# Altium project QUTMS-STRWHL-V00.PrjPcb
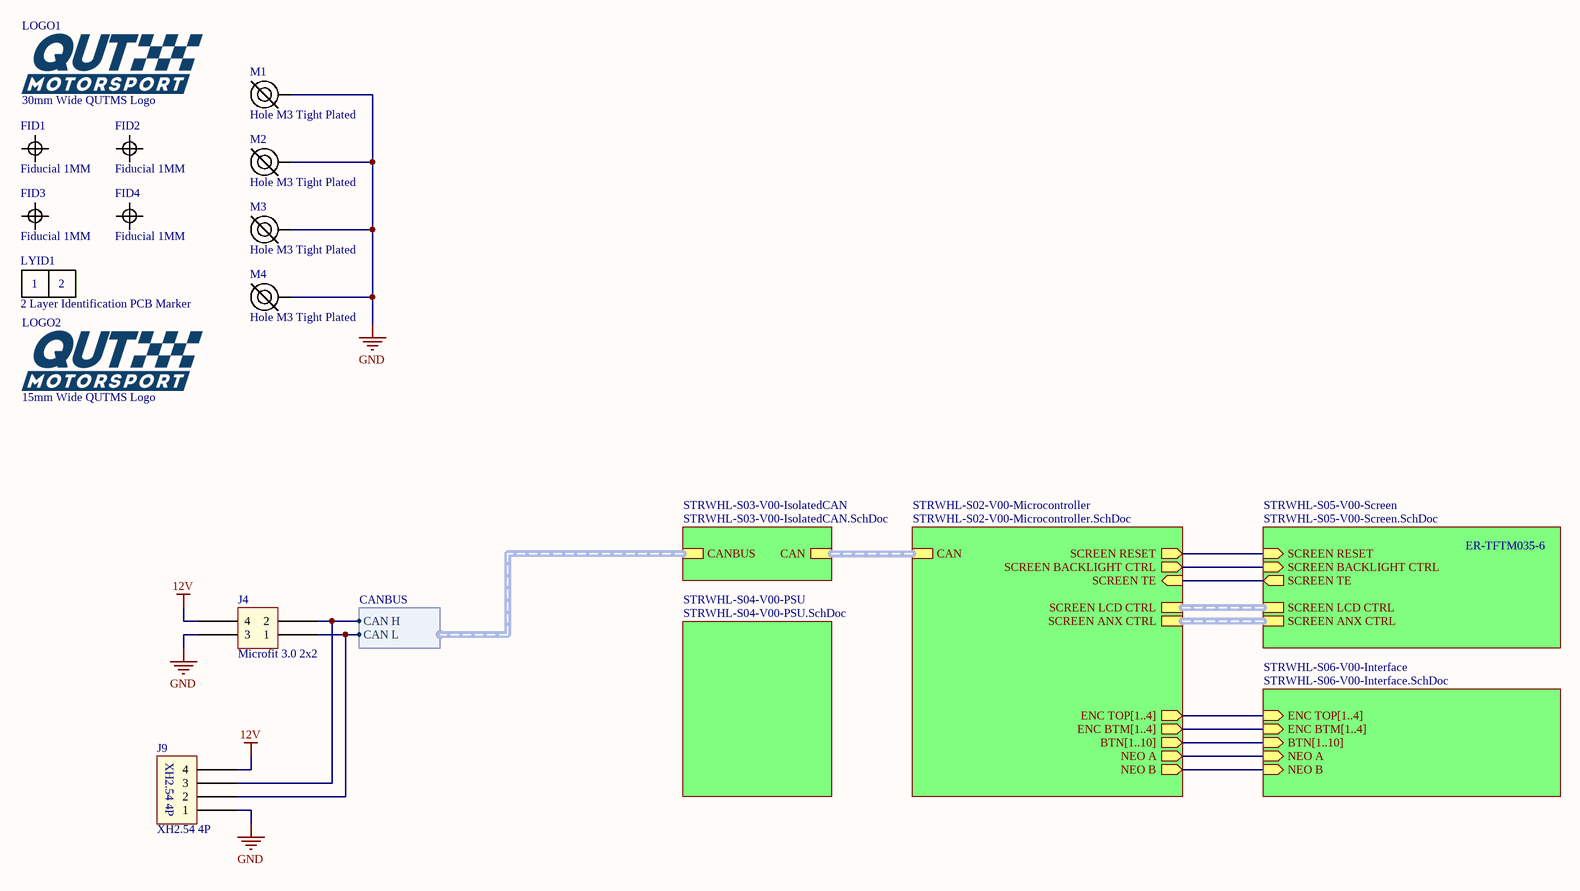
[diagram p0: STRWHL-S01-V00-SteeringWheel.SchDoc]
9 sheets, 176 parts. Net scope: hierarchical (ports join the sheet entries above them; power ports are global).
Board file: STRWHL-P01-V00.PcbDoc
Sheets:
  STRWHL-S01-V00-SteeringWheel.SchDoc
    STRWHL-S04-V00-PSU = STRWHL-S04-V00-PSU.SchDoc
    STRWHL-S02-V00-Microcontroller = STRWHL-S02-V00-Microcontroller.SchDoc
    STRWHL-S03-V00-IsolatedCAN = STRWHL-S03-V00-IsolatedCAN.SchDoc
    STRWHL-S06-V00-Interface = STRWHL-S06-V00-Interface.SchDoc
      STRWHL-S07-V00-EncoderInput1 = STRWHL-S07-V00-EncoderInput.SchDoc
      STRWHL-S07-V00-EncoderInput2 = STRWHL-S07-V00-EncoderInput.SchDoc
      STRWHL-S07-V00-EncoderInput3 = STRWHL-S07-V00-EncoderInput.SchDoc
      STRWHL-S07-V00-EncoderInput4 = STRWHL-S07-V00-EncoderInput.SchDoc
      STRWHL-S08-V00-ButtonInput1 = STRWHL-S08-V00-ButtonInput.SchDoc
      STRWHL-S08-V00-ButtonInput2 = STRWHL-S08-V00-ButtonInput.SchDoc
      STRWHL-S08-V00-ButtonInput3 = STRWHL-S08-V00-ButtonInput.SchDoc
      STRWHL-S08-V00-ButtonInput4 = STRWHL-S08-V00-ButtonInput.SchDoc
      STRWHL-S08-V00-ButtonInput5 = STRWHL-S08-V00-ButtonInput.SchDoc
      STRWHL-S08-V00-ButtonInput6 = STRWHL-S08-V00-ButtonInput.SchDoc
      STRWHL-S08-V00-ButtonInput7 = STRWHL-S08-V00-ButtonInput.SchDoc
      STRWHL-S08-V00-ButtonInput8 = STRWHL-S08-V00-ButtonInput.SchDoc
      STRWHL-S08-V00-ButtonInput9 = STRWHL-S08-V00-ButtonInput.SchDoc
      STRWHL-S08-V00-ButtonInput10 = STRWHL-S08-V00-ButtonInput.SchDoc
      STRWHL-S04-V00-PSU-LEDs = STRWHL-S04-V00-PSU-LEDs.SchDoc
    STRWHL-S05-V00-Screen = STRWHL-S05-V00-Screen.SchDoc

## Sheet STRWHL-S01-V00-SteeringWheel.SchDoc
size A3

### Parts
FID1  Fiducial 1MM  [FIDUCIAL 1MM]
FID2  Fiducial 1MM  [FIDUCIAL 1MM]
FID3  Fiducial 1MM  [FIDUCIAL 1MM]
FID4  Fiducial 1MM  [FIDUCIAL 1MM]
J4  Microfit 3.0 2x2  [Microfit_2X2_R_TH]
J9  XH2.54 4P  [JST_XH254_4P_TH_RH]
LOGO1  30mm Wide QUTMS Logo  [QUTMS LOGO 30MM]
LOGO2  15mm Wide QUTMS Logo  [QUTMS LOGO 15MM]
LYID1  2 Layer Identification PCB Marker  [LAYER IDENT 2]
M1  Hole M3 Tight Plated  [M3.2 PLATED]
M2  Hole M3 Tight Plated  [M3.2 PLATED]
M3  Hole M3 Tight Plated  [M3.2 PLATED]
M4  Hole M3 Tight Plated  [M3.2 PLATED]

### Sub-sheets
STRWHL-S02-V00-Microcontroller = STRWHL-S02-V00-Microcontroller.SchDoc: SCREEN LCD CTRL (harness SCREEN LCD CTRL), SCREEN ANX CTRL (harness SCREEN ANX CTRL), SCREEN TE (in), SCREEN BACKLIGHT CTRL (out), SCREEN RESET (out), CAN (harness CAN), ENC TOP[1..4] (out), ENC BTM[1..4] (out), BTN[1..10] (out), NEO A (out), NEO B (out)
STRWHL-S03-V00-IsolatedCAN = STRWHL-S03-V00-IsolatedCAN.SchDoc: CANBUS (harness CANBUS), CAN (harness CAN)
STRWHL-S04-V00-PSU = STRWHL-S04-V00-PSU.SchDoc: no entries
STRWHL-S05-V00-Screen = STRWHL-S05-V00-Screen.SchDoc: SCREEN ANX CTRL (harness SCREEN ANX CTRL), SCREEN LCD CTRL (harness SCREEN LCD CTRL), SCREEN TE (out), SCREEN BACKLIGHT CTRL (in), SCREEN RESET (in)
STRWHL-S06-V00-Interface = STRWHL-S06-V00-Interface.SchDoc: BTN[1..10] (in), ENC TOP[1..4] (in), NEO B (in), ENC BTM[1..4] (in), NEO A (in)

### Harnesses
CANBUS: CAN H, CAN L

### Nets
12V: J4.4 J9.4
GND: J4.3 J9.1 M1.1 M2.1 M3.1 M4.1
CAN H: J4.2 J9.3 ; sheet STRWHL-S03-V00-IsolatedCAN/CANBUS.CAN H
CAN L: J4.1 J9.2 ; sheet STRWHL-S03-V00-IsolatedCAN/CANBUS.CAN L
NEO A: sheet STRWHL-S02-V00-Microcontroller/NEO A, sheet STRWHL-S06-V00-Interface/NEO A
NEO B: sheet STRWHL-S02-V00-Microcontroller/NEO B, sheet STRWHL-S06-V00-Interface/NEO B
SCREEN BKLIGHT: sheet STRWHL-S02-V00-Microcontroller/SCREEN BACKLIGHT CTRL, sheet STRWHL-S05-V00-Screen/SCREEN BACKLIGHT CTRL
SCREEN RESET: sheet STRWHL-S02-V00-Microcontroller/SCREEN RESET, sheet STRWHL-S05-V00-Screen/SCREEN RESET
SCREEN TE: sheet STRWHL-S02-V00-Microcontroller/SCREEN TE, sheet STRWHL-S05-V00-Screen/SCREEN TE

### Buses and harness runs
bus sheet STRWHL-S02-V00-Microcontroller/BTN[1..10] = sheet STRWHL-S06-V00-Interface/BTN[1..10]
bus sheet STRWHL-S02-V00-Microcontroller/ENC BTM[1..4] = sheet STRWHL-S06-V00-Interface/ENC BTM[1..4]
bus sheet STRWHL-S02-V00-Microcontroller/ENC TOP[1..4] = sheet STRWHL-S06-V00-Interface/ENC TOP[1..4]
harness sheet STRWHL-S02-V00-Microcontroller/CAN = sheet STRWHL-S03-V00-IsolatedCAN/CAN
harness sheet STRWHL-S02-V00-Microcontroller/SCREEN ANX CTRL = sheet STRWHL-S05-V00-Screen/SCREEN ANX CTRL
harness sheet STRWHL-S02-V00-Microcontroller/SCREEN LCD CTRL = sheet STRWHL-S05-V00-Screen/SCREEN LCD CTRL

### Notes on the sheet
- ER-TFTM035-6
- Revision History:
- Sheet Title:
- Rev
- Date
- Description
- Project:
- Size:
- Drawn By:
- A3
- Number:
- Revision:
- Sheet
- Version:
- of
- QUT Motorsport
- O-120, Gardens Point
- 2 George Street
- Brisbane, QLD 4000
- Australia
- Print Date:
- Print Time:
- File Name:
- (in symbol Layer Identification 2) 1; 2

### Library data of the parts
J4 = Microfit_2x2
LOGO1 = QUTMS Logo 30mm
LOGO2 = QUTMS Logo 15mm
LYID1 = Layer Identification 2
M1-M4 = Hole M3 Tight Plated: M3.2 Hole, Plated

## Sheet STRWHL-S04-V00-PSU.SchDoc: Power Supply (9-25V to 3v3 @ 0.1-0.3A)
size A3; DrawnBy: Jonn Dillon; DocumentNumber: 4; Revision: 00; SheetNumber: 4; SheetTotal: 9; Project: Steering Wheel 2020; PageSetup: Record=PageOptions|CenterHorizontal=True|CenterVertical=True|PrintScale=0.97|XCorrection=1.00|YCorrection=1.00|PrintKind=0|BorderSize=5000000|LeftOffset=0|BottomOffset=0|Orientation=2|PaperLength=1000|PaperWidth=1000|Scale=100|PaperSource=7|PrintQuality=-4|MediaType=1|DitherType=10|PaperKind=A4|PrintScaleMode=1
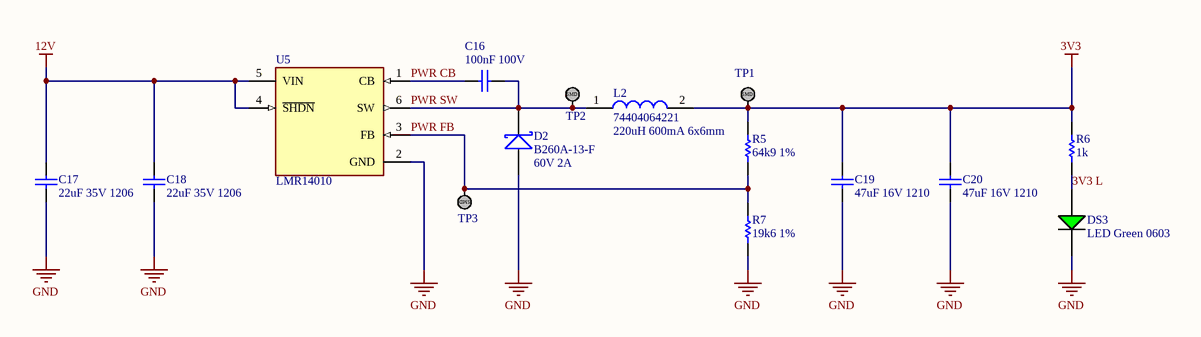
[diagram p1: STRWHL-S04-V00-PSU.SchDoc]

### Parts
C16  100nF 100V  [Cap_Ceramic_0603]
C17  22uF 35V 1206  [Cap_Ceramic_1206]
C18  22uF 35V 1206  [Cap_Ceramic_1206]
C19  47uF 16V 1210  [Cap_Ceramic_1210]
C20  47uF 16V 1210  [Cap_Ceramic_1210]
D2  B260A-13-F  [SMA]
DS3  LED Green 0603  [LED GREEN 0603]
L2  74404064221  [Inductor_6x6mm]
R5  64k9 1%  [Res_ThinFilm_0603]
R6  1k  [Res_ThinFilm_0603]
R7  19k6 1%  [Res_ThinFilm_0603]
TP1  TestPoint_SMD  [TestPointSMD]  (value not drawn)
TP2  TestPoint_SMD  [TestPointSMD]  (value not drawn)
TP3  TestPoint_SMD  [TestPointSMD]  (value not drawn)
U5  LMR14010  [LMR14010]

### Nets
3V3: C19.2 C20.2 L2.2 R5.2 R6.2 TP1.1
12V: C17.2 C18.2 U5.4(~{SHDN}) U5.5(VIN)
GND: C17.1 C18.1 C19.1 C20.1 D2.A DS3.2(C) R7.1 U5.2(GND)
3V3 L: DS3.1(A) R6.1
PWR CB: C16.1 U5.1(CB)
PWR FB: R5.1 R7.2 TP3.1 U5.3(FB)
PWR SW: C16.2 D2.K L2.1 TP2.1 U5.6(SW)

### Notes on the sheet
- (near L2) 220uH 600mA 6x6mm
- (near D2) 60V 2A
- Revision History:
- Sheet Title:
- Rev
- Date
- Description
- Project:
- Size:
- Drawn By:
- A3
- Number:
- Revision:
- Sheet
- Version:
- of
- QUT Motorsport
- O-120, Gardens Point
- 2 George Street
- Brisbane, QLD 4000
- Australia
- Print Date:
- Print Time:
- File Name:
- (in symbol TestPoint_SMD) SMD

### Library data of the parts
C16 = 100nF 100V 5% X7R 0603: Capacitor, Ceramic, SMD, 100nF, 100V, 5%, X7R, 0603
C17 C18 = 22uF 35V 10% X7R 1206: Capacitor, Ceramic, SMD, 22uF, 35V, 10%, X7R, 1206
C19 C20 = 47uF 16V 10% X7R 1210: Capacitor, Ceramic, SMD, 47uF, 16V, 5%, X7R, 1210
D2 = B260A-13-F: Diode, Schottky Barrier Rectifier, 60 V, 2 A, B260A-13-F
L2 = 74404064221: FIXED IND 220UH 660MA 850 MOHM; ComponentLink1Description: Digikey; ComponentLink1URL: https://www.digikey.com.au/product-detail/en/w%C3%BCrth-elektronik/74404064221/732-7261-1-ND/5353241; ComponentLink2Description: LCSC A; ComponentLink2URL: https://lcsc.com/product-detail/Power-Inductors_Sunlord-SWPA6045S221MT_C91047.html; ComponentLink3Description: LCSC B; ComponentLink3URL: https://lcsc.com/product-detail/Power-Inductors_SXN-Shun-Xiang-Nuo-Elec-SMNR6045-221MT_C467145.html
R5 = 64k9 1% 0603: Resistor, SMD, 64k9, 0.1W, 5%, 0603
R6 = 1k 5% 0603: Resistor, SMD, 1k, 0.1W, 5%, 0603
R7 = 19k6 1% 0603: Resistor, SMD, 19k6, 0.1W, 5%, 0603

## Sheet STRWHL-S02-V00-Microcontroller.SchDoc: Microcontroller
size A3; DrawnBy: Jonn DIllon; DocumentNumber: 2; Revision: 00; SheetNumber: 2; SheetTotal: 9; Project: Steering Wheel 2020; PageSetup: Record=PageOptions|CenterHorizontal=True|CenterVertical=True|PrintScale=0.97|XCorrection=1.00|YCorrection=1.00|PrintKind=0|BorderSize=5000000|LeftOffset=0|BottomOffset=0|Orientation=2|PaperLength=1000|PaperWidth=1000|Scale=100|PaperSource=7|PrintQuality=-4|MediaType=1|DitherType=10|PaperKind=A4|PrintScaleMode=1
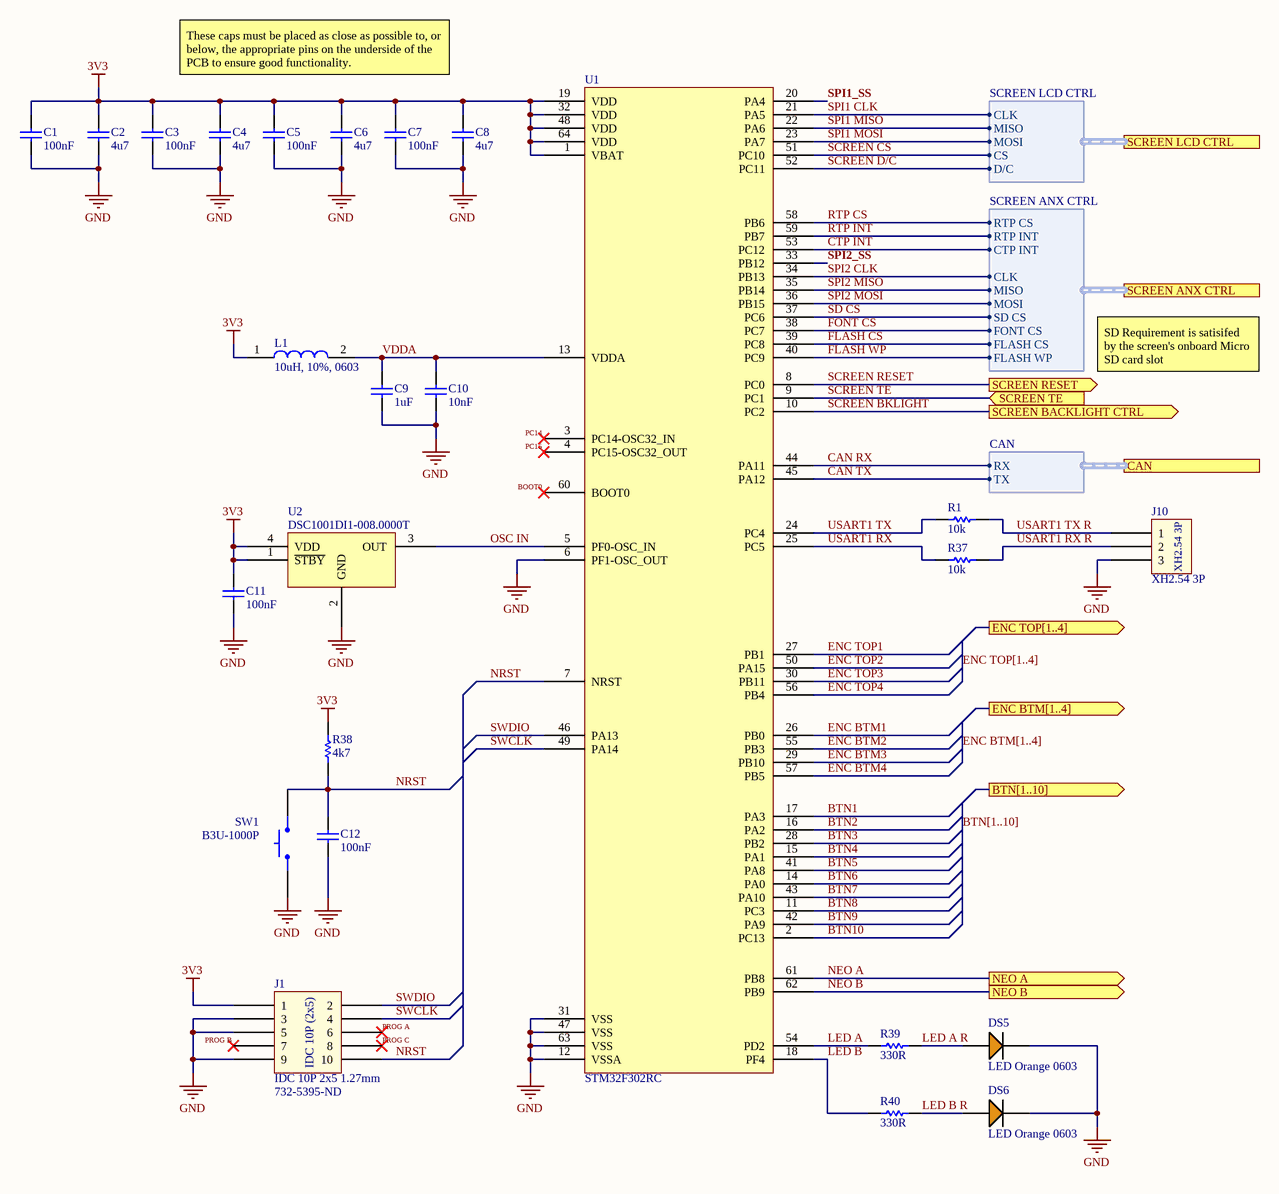
[diagram p2: STRWHL-S02-V00-Microcontroller.SchDoc]

### Parts
C1  100nF  [Cap_Ceramic_0603]
C2  4u7  [Cap_Ceramic_0603]
C3  100nF  [Cap_Ceramic_0603]
C4  4u7  [Cap_Ceramic_0603]
C5  100nF  [Cap_Ceramic_0603]
C6  4u7  [Cap_Ceramic_0603]
C7  100nF  [Cap_Ceramic_0603]
C8  4u7  [Cap_Ceramic_0603]
C9  1uF  [Cap_Ceramic_0603]
C10  10nF  [Cap_Ceramic_0603]
C11  100nF  [Cap_Ceramic_0603]
C12  100nF  [Cap_Ceramic_0603]
DS5  LED Orange 0603  [LED ORANGE 0603]
DS6  LED Orange 0603  [LED ORANGE 0603]
J1  IDC 10P 2x5 1.27mm  [IDC 1.27MM 10P]
J10  XH2.54 3P  [JST_XH254_3P_TH_RH]
L1  10uH, 10%, 0603  [Inductor_0603]
R1  10k  [Res_ThinFilm_0603]
R37  10k  [Res_ThinFilm_0603]
R38  4k7  [Res_ThinFilm_0603]
R39  330R  [Res_ThinFilm_0603]
R40  330R  [Res_ThinFilm_0603]
SW1  B3U-1000P  [BTN B3U-1000P]
U1  STM32F302RC  [STM32F302RC]
U2  DSC1001DI1-008.0000T  [DSC1001DI1-008.0000TCT-ND]

### Ports
BTN[1..10] (out), CAN (harness CAN), ENC BTM[1..4] (out), ENC TOP[1..4] (out), NEO A (out), NEO B (out), SCREEN ANX CTRL (harness SCREEN ANX CTRL), SCREEN BACKLIGHT CTRL (out), SCREEN LCD CTRL (harness SCREEN LCD CTRL), SCREEN RESET (out), SCREEN TE (in)

### Harnesses
CAN: RX, TX
SCREEN LCD CTRL: CLK, MOSI, MISO, CS, D/C
SCREEN ANX CTRL: CLK, MISO, MOSI, RTP CS, RTP INT, CTP INT, SD CS, FONT CS, FLASH CS, FLASH WP

### Nets
3V3: C1.2 C2.2 C3.2 C4.2 C5.2 C6.2 C7.2 C8.2 C11.2 J1.1 L1.1 R38.2 U1.1(VBAT) U1.19(VDD) U1.32(VDD) U1.48(VDD) U1.64(VDD) U2.1(~{STBY}) U2.4(VDD)
GND: C1.1 C2.1 C3.1 C4.1 C5.1 C6.1 C7.1 C8.1 C9.1 C10.1 C11.1 C12.1 DS5.2(C) DS6.2(C) J1.3 J1.5 J1.9 J10.3 SW1.1 U1.6(PF1-OSC_OUT) U1.12(VSSA) U1.31(VSS) U1.47(VSS) U1.63(VSS) U2.2(GND)
BOOT0: U1.60(BOOT0)
BTN1: U1.17(PA3)
BTN2: U1.16(PA2)
BTN3: U1.28(PB2)
BTN4: U1.15(PA1)
BTN5: U1.41(PA8)
BTN6: U1.14(PA0)
BTN7: U1.43(PA10)
BTN8: U1.11(PC3)
BTN9: U1.42(PA9)
BTN10: U1.2(PC13)
CAN RX: U1.44(PA11) ; port CAN.RX
CAN TX: U1.45(PA12) ; port CAN.TX
CTP INT: U1.53(PC12) ; port SCREEN ANX CTRL.CTP INT
ENC BTM1: U1.26(PB0)
ENC BTM2: U1.55(PB3)
ENC BTM3: U1.29(PB10)
ENC BTM4: U1.57(PB5)
ENC TOP1: U1.27(PB1)
ENC TOP2: U1.50(PA15)
ENC TOP3: U1.30(PB11)
ENC TOP4: U1.56(PB4)
FLASH CS: U1.39(PC8) ; port SCREEN ANX CTRL.FLASH CS
FLASH WP: U1.40(PC9) ; port SCREEN ANX CTRL.FLASH WP
FONT CS: U1.38(PC7) ; port SCREEN ANX CTRL.FONT CS
LED A: R39.1 U1.54(PD2)
LED A R: DS5.1(A) R39.2
LED B: R40.1 U1.18(PF4)
LED B R: DS6.1(A) R40.2
NEO A: U1.61(PB8) ; port NEO A
NEO B: U1.62(PB9) ; port NEO B
NRST: C12.2 J1.10 R38.1 SW1.2 U1.7(NRST)
OSC IN: U1.5(PF0-OSC_IN) U2.3(OUT)
PC14: U1.3(PC14-OSC32_IN)
PC15: U1.4(PC15-OSC32_OUT)
PROG A: J1.6
PROG B: J1.7
PROG C: J1.8
RTP CS: U1.58(PB6) ; port SCREEN ANX CTRL.RTP CS
RTP INT: U1.59(PB7) ; port SCREEN ANX CTRL.RTP INT
SCREEN BKLIGHT: U1.10(PC2) ; port SCREEN BACKLIGHT CTRL
SCREEN CS: U1.51(PC10) ; port SCREEN LCD CTRL.CS
SCREEN D/C: U1.52(PC11) ; port SCREEN LCD CTRL.D/C
SCREEN RESET: U1.8(PC0) ; port SCREEN RESET
SCREEN TE: U1.9(PC1) ; port SCREEN TE
SD CS: U1.37(PC6) ; port SCREEN ANX CTRL.SD CS
SPI1 CLK: U1.21(PA5) ; port SCREEN LCD CTRL.CLK
SPI1 MISO: U1.22(PA6) ; port SCREEN LCD CTRL.MISO
SPI1 MOSI: U1.23(PA7) ; port SCREEN LCD CTRL.MOSI
SPI1_SS: U1.20(PA4)
SPI2 CLK: U1.34(PB13) ; port SCREEN ANX CTRL.CLK
SPI2 MISO: U1.35(PB14) ; port SCREEN ANX CTRL.MISO
SPI2 MOSI: U1.36(PB15) ; port SCREEN ANX CTRL.MOSI
SPI2_SS: U1.33(PB12)
SWCLK: J1.4 U1.49(PA14)
SWDIO: J1.2 U1.46(PA13)
USART1 RX: R37.1 U1.25(PC5)
USART1 RX R: J10.2 R37.2
USART1 TX: R1.1 U1.24(PC4)
USART1 TX R: J10.1 R1.2
VDDA: C9.2 C10.2 L1.2 U1.13(VDDA)

### Buses and harness runs
bus BTN[1..10] = port BTN[1..10]
bus ENC BTM[1..4] = port ENC BTM[1..4]
bus ENC TOP[1..4] = port ENC TOP[1..4]

### Notes on the sheet
- These caps must be placed as close as possible to, or below, the appropriate pins on the underside of the PCB to ensure good functionality.
- SD Requirement is satisifed by the screen's onboard Micro SD card slot
- (near J1) 732-5395-ND
- Revision History:
- Sheet Title:
- Rev
- Date
- Description
- Project:
- Size:
- Drawn By:
- A3
- Number:
- Revision:
- Sheet
- Version:
- of
- QUT Motorsport
- O-120, Gardens Point
- 2 George Street
- Brisbane, QLD 4000
- Australia
- Print Date:
- Print Time:
- File Name:
- (in symbol IDC 10P 2x5 1.27mm) IDC 10P (2x5)

### Library data of the parts
C1 C3 C5 C7 C11 C12 = 100nF 50V 5% X7R 0603: Capacitor, Ceramic, SMD, 100nF, 50V, 5%, X7R, 0603
C2 C4 C6 C8 = 4u7 50V 5% X7R 0603: Capacitor, Ceramic, SMD, 4u7, 50V, 5%, X7R, 0603
C9 = 1uF 25V 5% X7R 0603: Capacitor, Ceramic, SMD, 1uF, 25V, 5%, X7R, 0603
C10 = 10nF 50V 5% X7R 0603: Capacitor, Ceramic, SMD, 10nF, 50V, 5%, X7R, 0603
R1 R37 = 10k 5% 0603: Resistor, SMD, 10k, 0.1W, 5%, 0603
R38 = 4k7 5% 0603: Resistor, SMD, 4k7, 0.1W, 5%, 0603
R39 R40 = 330R 5% 0603: Resistor, SMD, 330R, 0.1W, 5%, 0603
SW1 = BTN B3U-1000P: Omron B3U-1000P Ultra Miniture Switch; ComponentLink1Description: LCSC; ComponentLink1URL: https://lcsc.com/product-detail/Tactile-Switches_BRIGHT-TSA063G50-250_C294565.html
U1 = STM32F302RC: ARM® Cortex®-M4 STM32F3 Microcontroller IC 32-Bit 72MHz 256KB (256K x 8) FLASH 64-LQFP (10x10); ComponentLink1Description: Digikey; ComponentLink1URL: https://www.digikey.com.au/product-detail/en/stmicroelectronics/STM32F302RCT6TR/497-19000-1-ND/9974332; ComponentLink2Description: Datasheet; ComponentLink2URL: http://www.st.com/content/ccc/resource/technical/document/datasheet/67/73/21/b9/f2/b3/4d/f8/DM00094064.pdf/files/DM00094064.pdf/jcr:content/translations/en.DM00094064.pdf
U2 = DSC1001DI1-008.0000T: on 8MHz XO (Standard) CMOS Oscillator 1.8 ~ 3.3V Standby (Power Down) 4-SMD, No Lead
L1 = 10uH, 10%, 0603: ComponentLink1Description: Digikey; ComponentLink1URL: https://www.digikey.com.au/product-detail/en/w%C3%BCrth-elektronik/74404064221/732-7261-1-ND/5353241; ComponentLink2Description: LCSC A; ComponentLink2URL: https://lcsc.com/product-detail/Power-Inductors_Sunlord-SWPA6045S221MT_C91047.html; ComponentLink3Description: LCSC B; ComponentLink3URL: https://lcsc.com/product-detail/Power-Inductors_SXN-Shun-Xiang-Nuo-Elec-SMNR6045-221MT_C467145.html

## Sheet STRWHL-S03-V00-IsolatedCAN.SchDoc: CANBUS
size A3; DrawnBy: Jonn Dillon; DocumentNumber: 3; Revision: 00; SheetNumber: 3; SheetTotal: 9; Project: Steering Wheel 2020; PageSetup: Record=PageOptions|CenterHorizontal=True|CenterVertical=True|PrintScale=0.97|XCorrection=1.00|YCorrection=1.00|PrintKind=0|BorderSize=5000000|LeftOffset=0|BottomOffset=0|Orientation=2|PaperLength=1000|PaperWidth=1000|Scale=100|PaperSource=7|PrintQuality=-4|MediaType=1|DitherType=10|PaperKind=A4|PrintScaleMode=1
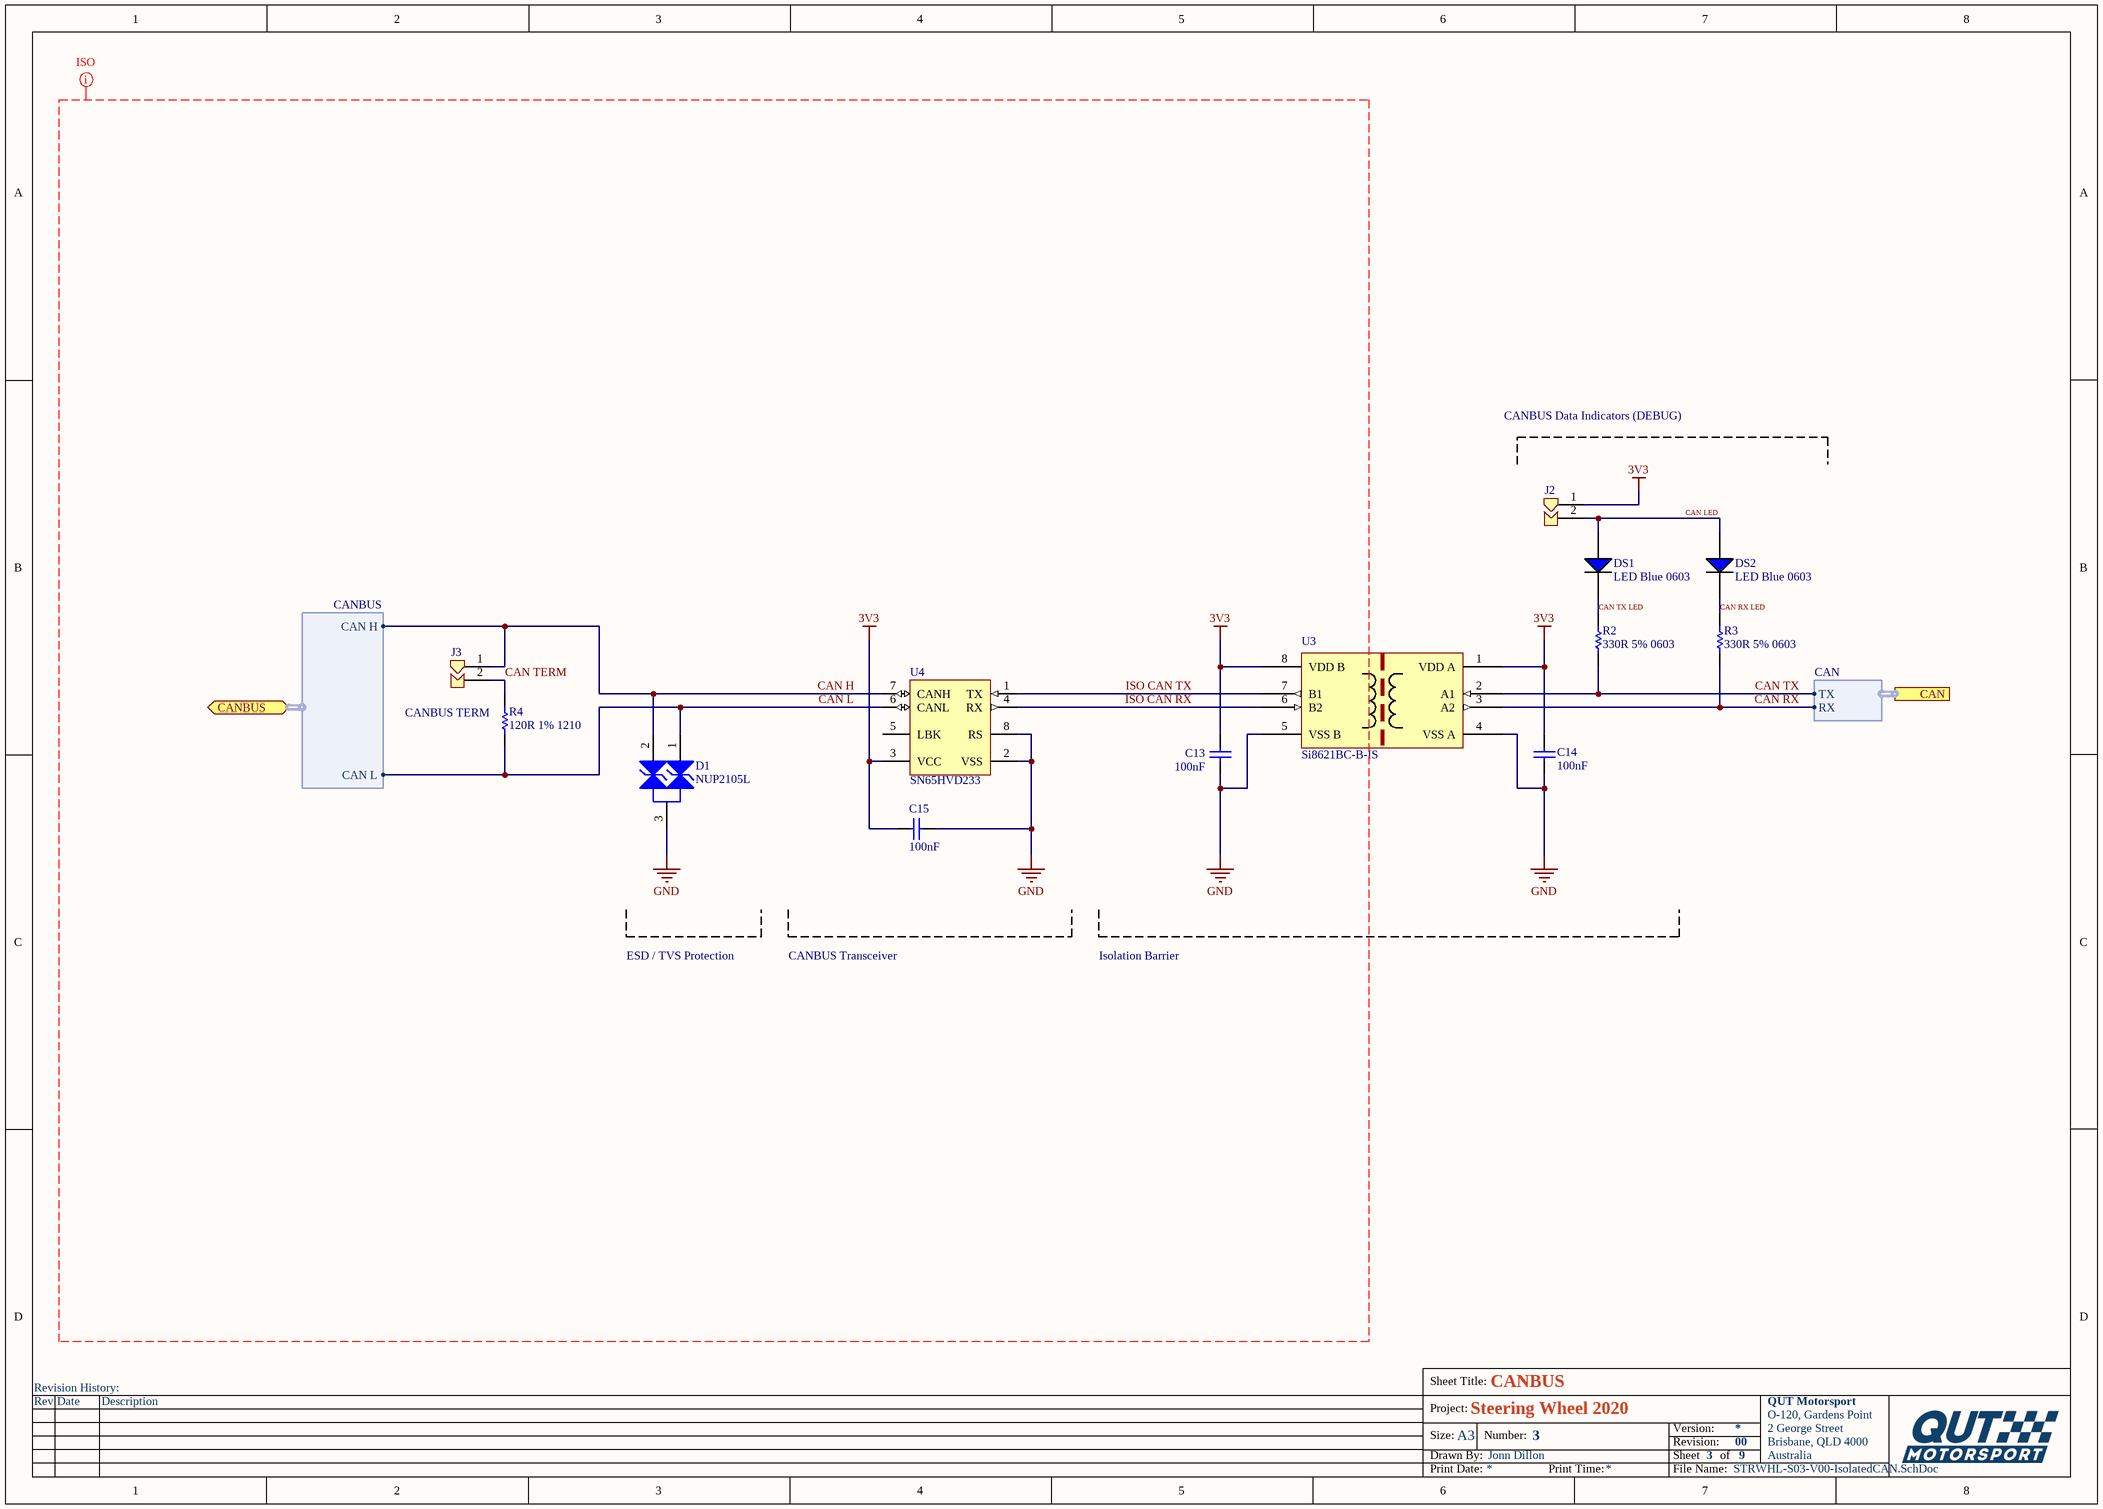
[diagram p3: STRWHL-S03-V00-IsolatedCAN.SchDoc]

### Parts
C13  100nF  [Cap_Ceramic_0603]
C14  100nF  [Cap_Ceramic_0603]
C15  100nF  [Cap_Ceramic_0603]
D1  NUP2105L  [NUP2105L]
DS1  LED Blue 0603  [LED BLUE 0603]
DS2  LED Blue 0603  [LED BLUE 0603]
J2  Jumper 2Way Solderable  [Jumper_2Way_Solderable]  (value not drawn)
J3  Jumper 2Way Solderable  [Jumper_2Way_Solderable]  (value not drawn)
R2  330R 5% 0603  [Res_ThinFilm_0603]
R3  330R 5% 0603  [Res_ThinFilm_0603]
R4  120R 1% 1210  [Res_ThinFilm_1210]
U3  Si8621BC-B-IS  [Si8621BC-B-IS]
U4  SN65HVD233  [SN65HVD233DR]

### Ports
CAN (harness CAN), CANBUS (bidir, harness CANBUS)

### Harnesses
CANBUS: CAN H, CAN L
CAN: RX, TX

### Nets
3V3: C13.2 C14.2 C15.2 J2.1 U3.1(VDD_A) U3.8(VDD_B) U4.3(VCC)
GND: C13.1 C14.1 C15.1 D1.3 U3.4(VSS_A) U3.5(VSS_B) U4.2(VSS) U4.8(RS)
CAN H: D1.2 J3.1 U4.7(CANH) ; port CANBUS.CAN H
CAN L: D1.1 R4.1 U4.6(CANL) ; port CANBUS.CAN L
CAN LED: DS1.1(A) DS2.1(A) J2.2
CAN RX: R3.1 U3.3(A2) ; port CAN.RX
CAN RX LED: DS2.2(C) R3.2
CAN TERM: J3.2 R4.2
CAN TX: R2.1 U3.2(A1) ; port CAN.TX
CAN TX LED: DS1.2(C) R2.2
ISO CAN RX: U3.6(B2) U4.4(RX)
ISO CAN TX: U3.7(B1) U4.1(TX)

Not connected (* = marked no-connect by the designer): U4 5(LBK)

### Layout directives
mark named ISO: 3V3, CAN H, CAN L, CAN TERM, GND, ISO CAN RX, ISO CAN TX

### Notes on the sheet
- CANBUS Data Indicators (DEBUG)
- (near R4) CANBUS TERM
- ESD / TVS Protection
- CANBUS Transceiver
- Isolation Barrier
- Revision History:
- Sheet Title:
- Rev
- Date
- Description
- Project:
- Size:
- Drawn By:
- A3
- Number:
- Revision:
- Sheet
- Version:
- of
- QUT Motorsport
- O-120, Gardens Point
- 2 George Street
- Brisbane, QLD 4000
- Australia
- Print Date:
- Print Time:
- File Name:

### Library data of the parts
C13-C15 = 100nF 50V 5% X7R 0603: as C1 on sheet STRWHL-S02-V00-Microcontroller
J2 J3 = Jumper 2Way Side Solderable
R2 R3 = 330R 5% 0603: Resistor, SMD, 330R, 0.1W, 5%, 0603
R4 = 120R 1% 1210: Resistor, SMD, 120R, 0.25W, 1%, 1210
D1 = NUP2105L: ComponentLink1Description: Datasheet; ComponentLink1URL: https://www.onsemi.cn/PowerSolutions/document/NUP2105L-D.PDF; Parameter 1: *; ComponentLink2Description: LCSC; ComponentLink2URL: https://lcsc.com/product-detail/TVS_ON-Semiconductor-NUP2105LT1G_C14486.html; ComponentLink3Description: Digikey; ComponentLink3URL: https://www.digikey.com.au/product-detail/en/on-semiconductor/SZNUP2105LT1G/SZNUP2105LT1GOSCT-ND/3487669
U3 = Si8621BC-B-IS: ComponentLink1Description: Digikey; ComponentLink1URL: https://www.digikey.com.au/product-detail/en/silicon-labs/SI8621BC-B-ISR/336-4774-1-ND/8611005; ComponentLink2Description: Datasheet; ComponentLink2URL: https://www.silabs.com/documents/public/data-sheets/si861x-2x-datasheet.pdf
U4 = SN65HVD233: ComponentLink1Description: LCSC; ComponentLink1URL: https://lcsc.com/product-detail/CAN-ICs_Texas-Instruments_SN65HVD233DRG4_Texas-Instruments-Texas-Instruments-SN65HVD233DRG4_C61643.html; ComponentLink2Description: Digikey; ComponentLink2URL: https://www.digikey.com.au/product-detail/en/texas-instruments/SN65HVD233DR/296-35967-1-ND/4134960; ComponentLink3Description: Datasheet; ComponentLink3URL: https://www.ti.com/lit/ds/symlink/sn65hvd233.pdf?ts=1588560888178; ComponentLink4Description: Ti Product Page; ComponentLink4URL: https://www.ti.com/product/SN65HVD233

## Sheet STRWHL-S06-V00-Interface.SchDoc
size A3
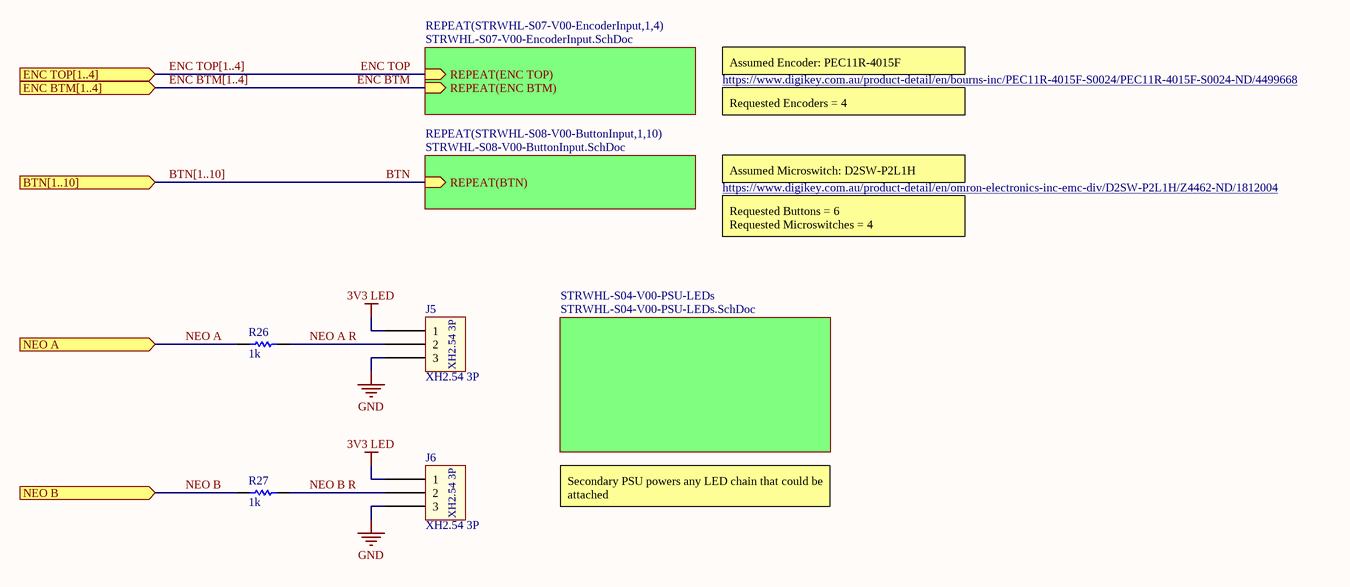
[diagram p4: STRWHL-S06-V00-Interface.SchDoc]

### Parts
J5  XH2.54 3P  [JST_XH254_3P_TH_RH]
J6  XH2.54 3P  [JST_XH254_3P_TH_RH]
R26  1k  [Res_ThinFilm_0603]
R27  1k  [Res_ThinFilm_0603]

### Sub-sheets
REPEAT(STRWHL-S07-V00-EncoderInput,1,4) = STRWHL-S07-V00-EncoderInput.SchDoc: REPEAT(ENC TOP) (in), REPEAT(ENC BTM) (in)
REPEAT(STRWHL-S08-V00-ButtonInput,1,10) = STRWHL-S08-V00-ButtonInput.SchDoc: REPEAT(BTN) (in)
STRWHL-S04-V00-PSU-LEDs = STRWHL-S04-V00-PSU-LEDs.SchDoc: no entries

### Ports
BTN[1..10] (in), ENC BTM[1..4] (in), ENC TOP[1..4] (in), NEO A (in), NEO B (in)

### Nets
3V3 LED: J5.1 J6.1
GND: J5.3 J6.3
BTN: sheet REPEAT(STRWHL-S08-V00-ButtonInput,1,10)/REPEAT(BTN)
ENC BTM: sheet REPEAT(STRWHL-S07-V00-EncoderInput,1,4)/REPEAT(ENC BTM)
ENC TOP: sheet REPEAT(STRWHL-S07-V00-EncoderInput,1,4)/REPEAT(ENC TOP)
NEO A: R26.1 ; port NEO A
NEO A R: J5.2 R26.2
NEO B: R27.1 ; port NEO B
NEO B R: J6.2 R27.2

### Buses and harness runs
bus BTN[1..10] = port BTN[1..10]
bus ENC BTM[1..4] = port ENC BTM[1..4]
bus ENC TOP[1..4] = port ENC TOP[1..4]

### Notes on the sheet
- Assumed Encoder: PEC11R-4015F
- https://www.digikey.com.au/product-detail/en/bourns-inc/PEC11R-4015F-S0024/PEC11R-4015F-S0024-ND/4499668
- Requested Encoders = 4
- https://www.digikey.com.au/product-detail/en/omron-electronics-inc-emc-div/D2SW-P2L1H/Z4462-ND/1812004
- Assumed Microswitch: D2SW-P2L1H
- Requested Buttons = 6
  Requested Microswitches = 4
- Secondary PSU powers any LED chain that could be attached
- Revision History:
- Sheet Title:
- Rev
- Date
- Description
- Project:
- Size:
- Drawn By:
- A3
- Number:
- Revision:
- Sheet
- Version:
- of
- QUT Motorsport
- O-120, Gardens Point
- 2 George Street
- Brisbane, QLD 4000
- Australia
- Print Date:
- Print Time:
- File Name:

### Library data of the parts
R26 R27 = 1k 5% 0603: Resistor, SMD, 1k, 0.1W, 5%, 0603

## Sheet STRWHL-S07-V00-EncoderInput.SchDoc: Encoder Input
size A3; DrawnBy: Jonn Dillon; DocumentNumber: 7; Revision: 00; SheetNumber: 7; SheetTotal: 9; Project: Steering Wheel 2020
Used 4 times, as channels STRWHL-S06-V00-Interface/STRWHL-S07-V00-EncoderInput1, STRWHL-S06-V00-Interface/STRWHL-S07-V00-EncoderInput2, STRWHL-S06-V00-Interface/STRWHL-S07-V00-EncoderInput3, STRWHL-S06-V00-Interface/STRWHL-S07-V00-EncoderInput4. Parts and nets are listed once, with the designators drawn on the sheet.
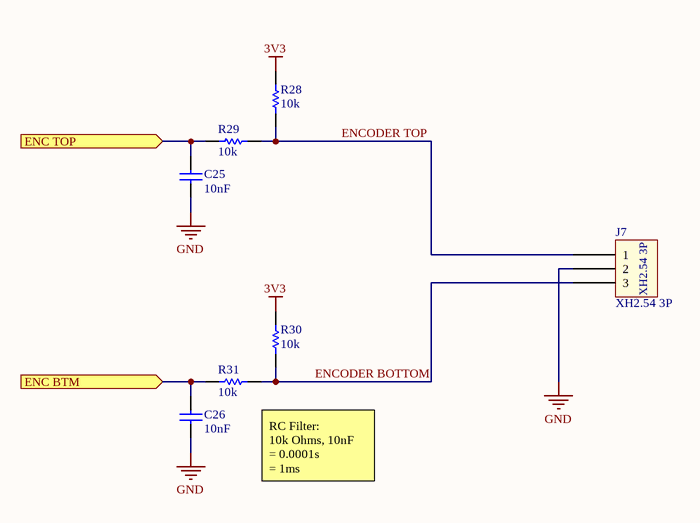
[diagram p5: STRWHL-S07-V00-EncoderInput.SchDoc]

### Parts
C25  10nF  [Cap_Ceramic_0603]
C26  10nF  [Cap_Ceramic_0603]
J7  XH2.54 3P  [JST_XH254_3P_TH_RH]
R28  10k  [Res_ThinFilm_0603]
R29  10k  [Res_ThinFilm_0603]
R30  10k  [Res_ThinFilm_0603]
R31  10k  [Res_ThinFilm_0603]

### Ports
ENC BTM (in), ENC TOP (in)

### Nets
3V3: R28.2 R30.2
GND: C25.1 C26.1 J7.2
ENC BTM: C26.2 R31.2 ; port ENC BTM
ENC TOP: C25.2 R29.1 ; port ENC TOP
ENCODER BOTTOM: J7.3 R30.1 R31.1
ENCODER TOP: J7.1 R28.1 R29.2

### Channels
STRWHL-S06-V00-Interface/STRWHL-S07-V00-EncoderInput1: designators end in A; ports ENC BTM=ENC BTM1 ENC TOP=ENC TOP1
STRWHL-S06-V00-Interface/STRWHL-S07-V00-EncoderInput2: designators end in B; ports ENC BTM=ENC BTM2 ENC TOP=ENC TOP2
STRWHL-S06-V00-Interface/STRWHL-S07-V00-EncoderInput3: designators end in C; ports ENC BTM=ENC BTM3 ENC TOP=ENC TOP3
STRWHL-S06-V00-Interface/STRWHL-S07-V00-EncoderInput4: designators end in D; ports ENC BTM=ENC BTM4 ENC TOP=ENC TOP4

### Notes on the sheet
- (near R31) RC Filter:
  10k Ohms, 10nF
  = 0.0001s
  = 1ms
- Revision History:
- Sheet Title:
- Rev
- Date
- Description
- Project:
- Size:
- Drawn By:
- A3
- Number:
- Revision:
- Sheet
- Version:
- of
- QUT Motorsport
- O-120, Gardens Point
- 2 George Street
- Brisbane, QLD 4000
- Australia
- Print Date:
- Print Time:
- File Name:

### Library data of the parts
C25 C26 = 10nF 50V 5% X7R 0603: as C10 on sheet STRWHL-S02-V00-Microcontroller
R28-R31 = 10k 5% 0603: Resistor, SMD, 10k, 0.1W, 5%, 0603

## Sheet STRWHL-S08-V00-ButtonInput.SchDoc: Button Input
size A3; DrawnBy: Jonn Dillon; DocumentNumber: 8; Revision: 00; SheetNumber: 8; SheetTotal: 9; Project: Steering Wheel 2020
Used 10 times, as channels STRWHL-S06-V00-Interface/STRWHL-S08-V00-ButtonInput1, STRWHL-S06-V00-Interface/STRWHL-S08-V00-ButtonInput2, STRWHL-S06-V00-Interface/STRWHL-S08-V00-ButtonInput3, STRWHL-S06-V00-Interface/STRWHL-S08-V00-ButtonInput4, STRWHL-S06-V00-Interface/STRWHL-S08-V00-ButtonInput5, STRWHL-S06-V00-Interface/STRWHL-S08-V00-ButtonInput6, STRWHL-S06-V00-Interface/STRWHL-S08-V00-ButtonInput7, STRWHL-S06-V00-Interface/STRWHL-S08-V00-ButtonInput8, STRWHL-S06-V00-Interface/STRWHL-S08-V00-ButtonInput9, STRWHL-S06-V00-Interface/STRWHL-S08-V00-ButtonInput10. Parts and nets are listed once, with the designators drawn on the sheet.
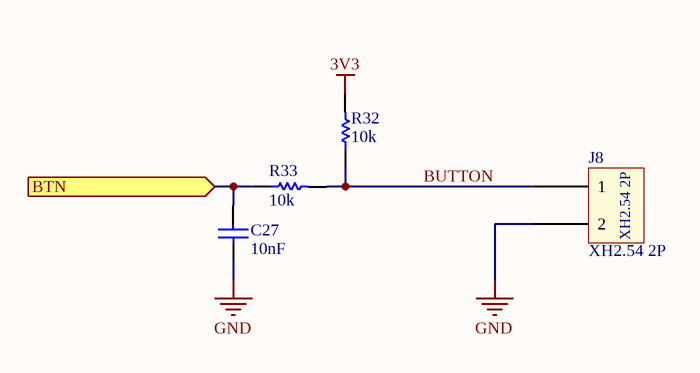
[diagram p6: STRWHL-S08-V00-ButtonInput.SchDoc]

### Parts
C27  10nF  [Cap_Ceramic_0603]
J8  XH2.54 2P  [JST_XH254_2P_TH_RH]
R32  10k  [Res_ThinFilm_0603]
R33  10k  [Res_ThinFilm_0603]

### Ports
BTN (in)

### Nets
3V3: R32.2
GND: C27.1 J8.2
BTN: C27.2 R33.1 ; port BTN
BUTTON: J8.1 R32.1 R33.2

### Channels
STRWHL-S06-V00-Interface/STRWHL-S08-V00-ButtonInput1: designators end in A; ports BTN=BTN1
STRWHL-S06-V00-Interface/STRWHL-S08-V00-ButtonInput2: designators end in B; ports BTN=BTN2
STRWHL-S06-V00-Interface/STRWHL-S08-V00-ButtonInput3: designators end in C; ports BTN=BTN3
STRWHL-S06-V00-Interface/STRWHL-S08-V00-ButtonInput4: designators end in D; ports BTN=BTN4
STRWHL-S06-V00-Interface/STRWHL-S08-V00-ButtonInput5: designators end in E; ports BTN=BTN5
STRWHL-S06-V00-Interface/STRWHL-S08-V00-ButtonInput6: designators end in F; ports BTN=BTN6
STRWHL-S06-V00-Interface/STRWHL-S08-V00-ButtonInput7: designators end in G; ports BTN=BTN7
STRWHL-S06-V00-Interface/STRWHL-S08-V00-ButtonInput8: designators end in H; ports BTN=BTN8
STRWHL-S06-V00-Interface/STRWHL-S08-V00-ButtonInput9: designators end in I; ports BTN=BTN9
STRWHL-S06-V00-Interface/STRWHL-S08-V00-ButtonInput10: designators end in J; ports BTN=BTN10

### Notes on the sheet
- Revision History:
- Sheet Title:
- Rev
- Date
- Description
- Project:
- Size:
- Drawn By:
- A3
- Number:
- Revision:
- Sheet
- Version:
- of
- QUT Motorsport
- O-120, Gardens Point
- 2 George Street
- Brisbane, QLD 4000
- Australia
- Print Date:
- Print Time:
- File Name:

### Library data of the parts
C27 = 10nF 50V 5% X7R 0603: as C10 on sheet STRWHL-S02-V00-Microcontroller
R32 R33 = 10k 5% 0603: Resistor, SMD, 10k, 0.1W, 5%, 0603

## Sheet STRWHL-S04-V00-PSU-LEDs.SchDoc: Power Supply (20-40V to 3v3 @ 0.1-0.6A)
size A3; DrawnBy: Jonn Dillon; DocumentNumber: 7; Revision: 01; SheetNumber: 7; SheetTotal: 9; Version: 01; Project: Battery Management System 2020; PageSetup: Record=PageOptions|CenterHorizontal=True|CenterVertical=True|PrintScale=0.97|XCorrection=1.00|YCorrection=1.00|PrintKind=0|BorderSize=5000000|LeftOffset=0|BottomOffset=0|Orientation=2|PaperLength=1000|PaperWidth=1000|Scale=100|PaperSource=7|PrintQuality=-4|MediaType=1|DitherType=10|PaperKind=A4|PrintScaleMode=1
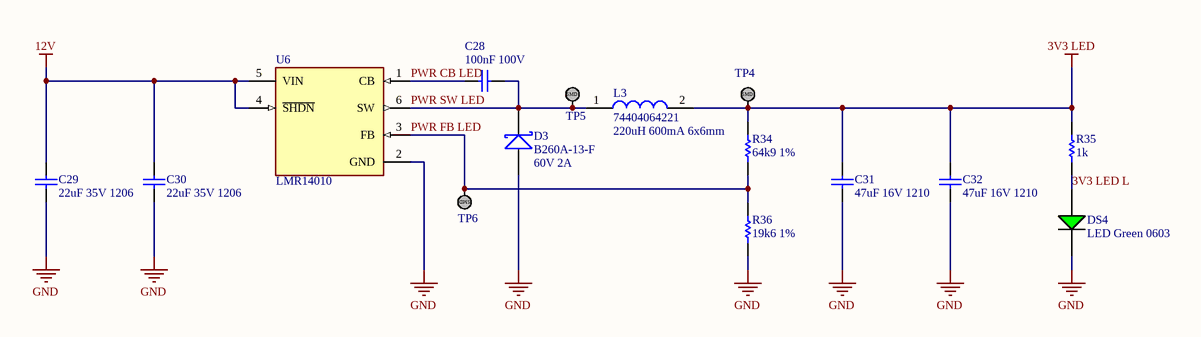
[diagram p7: STRWHL-S04-V00-PSU-LEDs.SchDoc]

### Parts
C28  100nF 100V  [Cap_Ceramic_0603]
C29  22uF 35V 1206  [Cap_Ceramic_1206]
C30  22uF 35V 1206  [Cap_Ceramic_1206]
C31  47uF 16V 1210  [Cap_Ceramic_1210]
C32  47uF 16V 1210  [Cap_Ceramic_1210]
D3  B260A-13-F  [SMA]
DS4  LED Green 0603  [LED GREEN 0603]
L3  74404064221  [Inductor_6x6mm]
R34  64k9 1%  [Res_ThinFilm_0603]
R35  1k  [Res_ThinFilm_0603]
R36  19k6 1%  [Res_ThinFilm_0603]
TP4  TestPoint_SMD  [TestPointSMD]  (value not drawn)
TP5  TestPoint_SMD  [TestPointSMD]  (value not drawn)
TP6  TestPoint_SMD  [TestPointSMD]  (value not drawn)
U6  LMR14010  [LMR14010]

### Nets
3V3 LED: C31.2 C32.2 L3.2 R34.2 R35.2 TP4.1
12V: C29.2 C30.2 U6.4(~{SHDN}) U6.5(VIN)
GND: C29.1 C30.1 C31.1 C32.1 D3.A DS4.2(C) R36.1 U6.2(GND)
3V3 LED L: DS4.1(A) R35.1
PWR CB LED: C28.1 U6.1(CB)
PWR FB LED: R34.1 R36.2 TP6.1 U6.3(FB)
PWR SW LED: C28.2 D3.K L3.1 TP5.1 U6.6(SW)

### Notes on the sheet
- (near L3) 220uH 600mA 6x6mm
- (near D3) 60V 2A
- Revision History:
- Sheet Title:
- Rev
- Date
- Description
- Project:
- Size:
- Drawn By:
- A3
- Number:
- Revision:
- Sheet
- Version:
- of
- QUT Motorsport
- O-120, Gardens Point
- 2 George Street
- Brisbane, QLD 4000
- Australia
- Print Date:
- Print Time:
- File Name:
- (in symbol TestPoint_SMD) SMD

### Library data of the parts
C28 = 100nF 100V 5% X7R 0603: as C16 on sheet STRWHL-S04-V00-PSU
C29 C30 = 22uF 35V 10% X7R 1206: as C17 on sheet STRWHL-S04-V00-PSU
C31 C32 = 47uF 16V 10% X7R 1210: as C19 on sheet STRWHL-S04-V00-PSU
D3 = B260A-13-F: as D2 on sheet STRWHL-S04-V00-PSU
L3 = 74404064221: FIXED IND 220UH 660MA 850 MOHM; ComponentLink1Description: Digikey; ComponentLink1URL: https://www.digikey.com.au/product-detail/en/w%C3%BCrth-elektronik/74404064221/732-7261-1-ND/5353241; ComponentLink2Description: LCSC A; ComponentLink2URL: https://lcsc.com/product-detail/Power-Inductors_Sunlord-SWPA6045S221MT_C91047.html; ComponentLink3Description: LCSC B; ComponentLink3URL: https://lcsc.com/product-detail/Power-Inductors_SXN-Shun-Xiang-Nuo-Elec-SMNR6045-221MT_C467145.html
R34 = 64k9 1% 0603: Resistor, SMD, 64k9, 0.1W, 5%, 0603
R35 = 1k 5% 0603: Resistor, SMD, 1k, 0.1W, 5%, 0603
R36 = 19k6 1% 0603: Resistor, SMD, 19k6, 0.1W, 5%, 0603

## Sheet STRWHL-S05-V00-Screen.SchDoc: Screen Interface (ER-TFTM035-6)
size A3; DrawnBy: Jonn Dillon; DocumentNumber: 5; Revision: 00; SheetNumber: 5; SheetTotal: 9; Project: Steering Wheel 2020
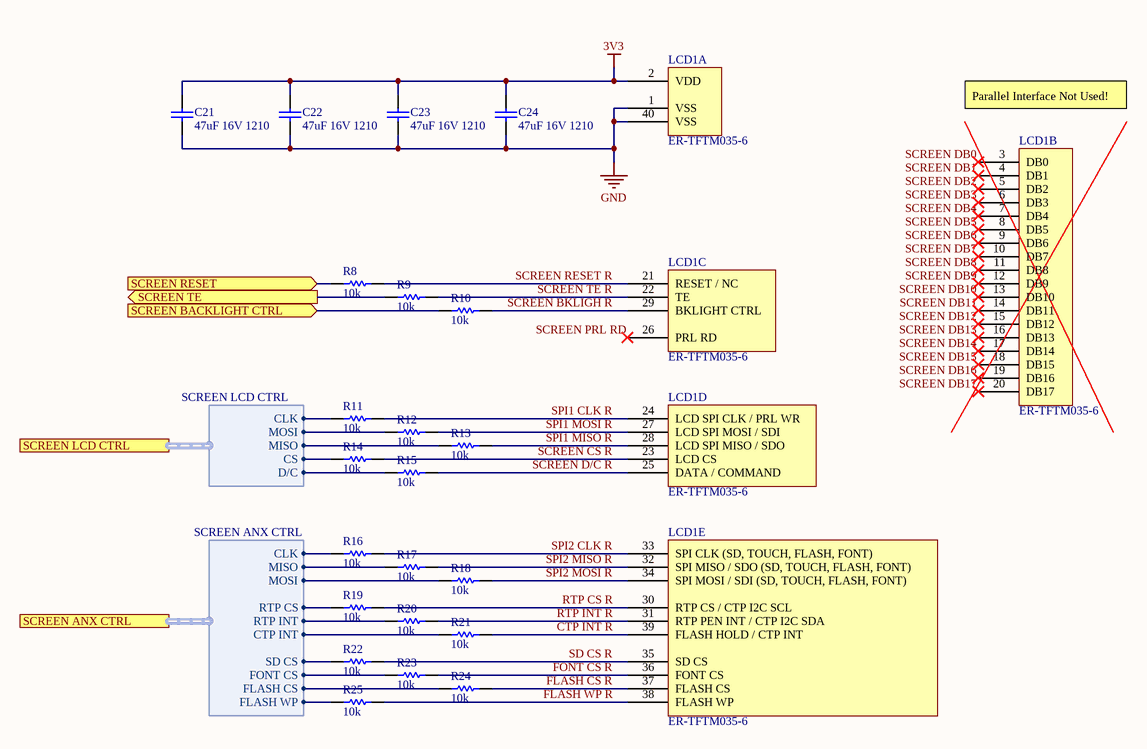
[diagram p8: STRWHL-S05-V00-Screen.SchDoc]

### Parts
C21  47uF 16V 1210  [Cap_Ceramic_1210]
C22  47uF 16V 1210  [Cap_Ceramic_1210]
C23  47uF 16V 1210  [Cap_Ceramic_1210]
C24  47uF 16V 1210  [Cap_Ceramic_1210]
LCD1  ER-TFTM035-6  [ER-TFTM035-6]  (parts A,B,C,D,E of 5)
R8  10k  [Res_ThinFilm_0603]
R9  10k  [Res_ThinFilm_0603]
R10  10k  [Res_ThinFilm_0603]
R11  10k  [Res_ThinFilm_0603]
R12  10k  [Res_ThinFilm_0603]
R13  10k  [Res_ThinFilm_0603]
R14  10k  [Res_ThinFilm_0603]
R15  10k  [Res_ThinFilm_0603]
R16  10k  [Res_ThinFilm_0603]
R17  10k  [Res_ThinFilm_0603]
R18  10k  [Res_ThinFilm_0603]
R19  10k  [Res_ThinFilm_0603]
R20  10k  [Res_ThinFilm_0603]
R21  10k  [Res_ThinFilm_0603]
R22  10k  [Res_ThinFilm_0603]
R23  10k  [Res_ThinFilm_0603]
R24  10k  [Res_ThinFilm_0603]
R25  10k  [Res_ThinFilm_0603]

### Ports
SCREEN ANX CTRL (harness SCREEN ANX CTRL), SCREEN BACKLIGHT CTRL (in), SCREEN LCD CTRL (harness SCREEN LCD CTRL), SCREEN RESET (in), SCREEN TE (out)

### Harnesses
SCREEN LCD CTRL: CLK, MOSI, MISO, CS, D/C
SCREEN ANX CTRL: CLK, MISO, MOSI, RTP CS, RTP INT, CTP INT, SD CS, FONT CS, FLASH CS, FLASH WP

### Nets
3V3: C21.2 C22.2 C23.2 C24.2 LCD1.2(VDD)
GND: C21.1 C22.1 C23.1 C24.1 LCD1.1(VSS) LCD1.40(VSS)
CTP INT: R21.2 ; port SCREEN ANX CTRL.CTP INT
CTP INT R: LCD1.39(FLASH_HOLD_/_CTP_INT) R21.1
FLASH CS: R24.2 ; port SCREEN ANX CTRL.FLASH CS
FLASH CS R: LCD1.37(FLASH_CS) R24.1
FLASH WP: R25.2 ; port SCREEN ANX CTRL.FLASH WP
FLASH WP R: LCD1.38(FLASH_WP) R25.1
FONT CS: R23.2 ; port SCREEN ANX CTRL.FONT CS
FONT CS R: LCD1.36(FONT_CS) R23.1
RTP CS: R19.2 ; port SCREEN ANX CTRL.RTP CS
RTP CS R: LCD1.30(RTP_CS_/_CTP_I2C_SCL) R19.1
RTP INT: R20.2 ; port SCREEN ANX CTRL.RTP INT
RTP INT R: LCD1.31(RTP_PEN_INT_/_CTP_I2C_SDA) R20.1
SCREEN BKLIGH R: LCD1.29(BKLIGHT_CTRL) R10.1
SCREEN BKLIGHT: R10.2 ; port SCREEN BACKLIGHT CTRL
SCREEN CS: R14.2 ; port SCREEN LCD CTRL.CS
SCREEN CS R: LCD1.23(LCD_CS) R14.1
SCREEN D/C: R15.2 ; port SCREEN LCD CTRL.D/C
SCREEN D/C R: LCD1.25(DATA_/_COMMAND) R15.1
SCREEN DB0: LCD1.3(DB0)
SCREEN DB1: LCD1.4(DB1)
SCREEN DB2: LCD1.5(DB2)
SCREEN DB3: LCD1.6(DB3)
SCREEN DB4: LCD1.7(DB4)
SCREEN DB5: LCD1.8(DB5)
SCREEN DB6: LCD1.9(DB6)
SCREEN DB7: LCD1.10(DB7)
SCREEN DB8: LCD1.11(DB8)
SCREEN DB9: LCD1.12(DB9)
SCREEN DB10: LCD1.13(DB10)
SCREEN DB11: LCD1.14(DB11)
SCREEN DB12: LCD1.15(DB12)
SCREEN DB13: LCD1.16(DB13)
SCREEN DB14: LCD1.17(DB14)
SCREEN DB15: LCD1.18(DB15)
SCREEN DB16: LCD1.19(DB16)
SCREEN DB17: LCD1.20(DB17)
SCREEN PRL RD: LCD1.26(PRL_RD)
SCREEN RESET: R8.2 ; port SCREEN RESET
SCREEN RESET R: LCD1.21(RESET_/_NC) R8.1
SCREEN TE: R9.2 ; port SCREEN TE
SCREEN TE R: LCD1.22(TE) R9.1
SD CS: R22.2 ; port SCREEN ANX CTRL.SD CS
SD CS R: LCD1.35(SD_CS) R22.1
SPI1 CLK: R11.2 ; port SCREEN LCD CTRL.CLK
SPI1 CLK R: LCD1.24(LCD_SPI_CLK_/_PRL_WR) R11.1
SPI1 MISO: R13.2 ; port SCREEN LCD CTRL.MISO
SPI1 MISO R: LCD1.28(LCD_SPI_MISO_/_SDO) R13.1
SPI1 MOSI: R12.2 ; port SCREEN LCD CTRL.MOSI
SPI1 MOSI R: LCD1.27(LCD_SPI_MOSI_/_SDI) R12.1
SPI2 CLK: R16.2 ; port SCREEN ANX CTRL.CLK
SPI2 CLK R: LCD1.33(SPI_CLK_(SD,_TOUCH,_FLASH,_FONT)) R16.1
SPI2 MISO: R17.2 ; port SCREEN ANX CTRL.MISO
SPI2 MISO R: LCD1.32(SPI_MISO_/_SDO_(SD,_TOUCH,_FLASH,_FONT)) R17.1
SPI2 MOSI: R18.2 ; port SCREEN ANX CTRL.MOSI
SPI2 MOSI R: LCD1.34(SPI_MOSI_/_SDI_(SD,_TOUCH,_FLASH,_FONT)) R18.1

### Notes on the sheet
- Parallel Interface Not Used!
- Revision History:
- Sheet Title:
- Rev
- Date
- Description
- Project:
- Size:
- Drawn By:
- A3
- Number:
- Revision:
- Sheet
- Version:
- of
- QUT Motorsport
- O-120, Gardens Point
- 2 George Street
- Brisbane, QLD 4000
- Australia
- Print Date:
- Print Time:
- File Name:

### Library data of the parts
C21-C24 = 47uF 16V 10% X7R 1210: as C19 on sheet STRWHL-S04-V00-PSU
LCD1 = ER-TFTM035-6: LCD 3.5" 320x480 TFT Display Module, OPTL Touch Screen w/Breakout Board; ComponentLink1Description: Website; ComponentLink1URL: https://www.buydisplay.com/lcd-3-5-inch-320x480-tft-display-module-optl-touch-screen-w-breakout-board
R8-R25 = 10k 5% 0603: Resistor, SMD, 10k, 0.1W, 5%, 0603

## Nets that join several sheets
3V3: STRWHL-S04-V00-PSU (6 pins), STRWHL-S02-V00-Microcontroller (19 pins), STRWHL-S03-V00-IsolatedCAN (7 pins), STRWHL-S06-V00-Interface/STRWHL-S07-V00-EncoderInput1 (R28A.2 R30A.2), STRWHL-S06-V00-Interface/STRWHL-S07-V00-EncoderInput2 (R28B.2 R30B.2), STRWHL-S06-V00-Interface/STRWHL-S07-V00-EncoderInput3 (R28C.2 R30C.2), STRWHL-S06-V00-Interface/STRWHL-S07-V00-EncoderInput4 (R28D.2 R30D.2), STRWHL-S06-V00-Interface/STRWHL-S08-V00-ButtonInput1 (R32A.2), STRWHL-S06-V00-Interface/STRWHL-S08-V00-ButtonInput2 (R32B.2), STRWHL-S06-V00-Interface/STRWHL-S08-V00-ButtonInput3 (R32C.2), STRWHL-S06-V00-Interface/STRWHL-S08-V00-ButtonInput4 (R32D.2), STRWHL-S06-V00-Interface/STRWHL-S08-V00-ButtonInput5 (R32E.2), STRWHL-S06-V00-Interface/STRWHL-S08-V00-ButtonInput6 (R32F.2), STRWHL-S06-V00-Interface/STRWHL-S08-V00-ButtonInput7 (R32G.2), STRWHL-S06-V00-Interface/STRWHL-S08-V00-ButtonInput8 (R32H.2), STRWHL-S06-V00-Interface/STRWHL-S08-V00-ButtonInput9 (R32I.2), STRWHL-S06-V00-Interface/STRWHL-S08-V00-ButtonInput10 (R32J.2), STRWHL-S05-V00-Screen (5 pins)
3V3 LED: STRWHL-S06-V00-Interface (J5.1 J6.1), STRWHL-S04-V00-PSU-LEDs (6 pins)
12V: STRWHL-S01-V00-SteeringWheel (J4.4 J9.4), STRWHL-S04-V00-PSU (C17.2 C18.2 U5.4 U5.5), STRWHL-S04-V00-PSU-LEDs (C29.2 C30.2 U6.4 U6.5)
GND: STRWHL-S01-V00-SteeringWheel (6 pins), STRWHL-S04-V00-PSU (8 pins), STRWHL-S02-V00-Microcontroller (25 pins), STRWHL-S03-V00-IsolatedCAN (8 pins), STRWHL-S06-V00-Interface (J5.3 J6.3), STRWHL-S06-V00-Interface/STRWHL-S07-V00-EncoderInput1 (C25A.1 C26A.1 J7A.2), STRWHL-S06-V00-Interface/STRWHL-S07-V00-EncoderInput2 (C25B.1 C26B.1 J7B.2), STRWHL-S06-V00-Interface/STRWHL-S07-V00-EncoderInput3 (C25C.1 C26C.1 J7C.2), STRWHL-S06-V00-Interface/STRWHL-S07-V00-EncoderInput4 (C25D.1 C26D.1 J7D.2), STRWHL-S06-V00-Interface/STRWHL-S08-V00-ButtonInput1 (C27A.1 J8A.2), STRWHL-S06-V00-Interface/STRWHL-S08-V00-ButtonInput2 (C27B.1 J8B.2), STRWHL-S06-V00-Interface/STRWHL-S08-V00-ButtonInput3 (C27C.1 J8C.2), STRWHL-S06-V00-Interface/STRWHL-S08-V00-ButtonInput4 (C27D.1 J8D.2), STRWHL-S06-V00-Interface/STRWHL-S08-V00-ButtonInput5 (C27E.1 J8E.2), STRWHL-S06-V00-Interface/STRWHL-S08-V00-ButtonInput6 (C27F.1 J8F.2), STRWHL-S06-V00-Interface/STRWHL-S08-V00-ButtonInput7 (C27G.1 J8G.2), STRWHL-S06-V00-Interface/STRWHL-S08-V00-ButtonInput8 (C27H.1 J8H.2), STRWHL-S06-V00-Interface/STRWHL-S08-V00-ButtonInput9 (C27I.1 J8I.2), STRWHL-S06-V00-Interface/STRWHL-S08-V00-ButtonInput10 (C27J.1 J8J.2), STRWHL-S04-V00-PSU-LEDs (8 pins), STRWHL-S05-V00-Screen (6 pins)
BTN1: STRWHL-S02-V00-Microcontroller (U1.17), STRWHL-S06-V00-Interface/STRWHL-S08-V00-ButtonInput1 (C27A.2 R33A.1)
BTN2: STRWHL-S02-V00-Microcontroller (U1.16), STRWHL-S06-V00-Interface/STRWHL-S08-V00-ButtonInput2 (C27B.2 R33B.1)
BTN3: STRWHL-S02-V00-Microcontroller (U1.28), STRWHL-S06-V00-Interface/STRWHL-S08-V00-ButtonInput3 (C27C.2 R33C.1)
BTN4: STRWHL-S02-V00-Microcontroller (U1.15), STRWHL-S06-V00-Interface/STRWHL-S08-V00-ButtonInput4 (C27D.2 R33D.1)
BTN5: STRWHL-S02-V00-Microcontroller (U1.41), STRWHL-S06-V00-Interface/STRWHL-S08-V00-ButtonInput5 (C27E.2 R33E.1)
BTN6: STRWHL-S02-V00-Microcontroller (U1.14), STRWHL-S06-V00-Interface/STRWHL-S08-V00-ButtonInput6 (C27F.2 R33F.1)
BTN7: STRWHL-S02-V00-Microcontroller (U1.43), STRWHL-S06-V00-Interface/STRWHL-S08-V00-ButtonInput7 (C27G.2 R33G.1)
BTN8: STRWHL-S02-V00-Microcontroller (U1.11), STRWHL-S06-V00-Interface/STRWHL-S08-V00-ButtonInput8 (C27H.2 R33H.1)
BTN9: STRWHL-S02-V00-Microcontroller (U1.42), STRWHL-S06-V00-Interface/STRWHL-S08-V00-ButtonInput9 (C27I.2 R33I.1)
BTN10: STRWHL-S02-V00-Microcontroller (U1.2), STRWHL-S06-V00-Interface/STRWHL-S08-V00-ButtonInput10 (C27J.2 R33J.1)
CAN H: STRWHL-S01-V00-SteeringWheel (J4.2 J9.3), STRWHL-S03-V00-IsolatedCAN (D1.2 J3.1 U4.7)
CAN L: STRWHL-S01-V00-SteeringWheel (J4.1 J9.2), STRWHL-S03-V00-IsolatedCAN (D1.1 R4.1 U4.6)
CAN RX: STRWHL-S02-V00-Microcontroller (U1.44), STRWHL-S03-V00-IsolatedCAN (R3.1 U3.3)
CAN TX: STRWHL-S02-V00-Microcontroller (U1.45), STRWHL-S03-V00-IsolatedCAN (R2.1 U3.2)
CTP INT: STRWHL-S02-V00-Microcontroller (U1.53), STRWHL-S05-V00-Screen (R21.2)
ENC BTM1: STRWHL-S02-V00-Microcontroller (U1.26), STRWHL-S06-V00-Interface/STRWHL-S07-V00-EncoderInput1 (C26A.2 R31A.2)
ENC BTM2: STRWHL-S02-V00-Microcontroller (U1.55), STRWHL-S06-V00-Interface/STRWHL-S07-V00-EncoderInput2 (C26B.2 R31B.2)
ENC BTM3: STRWHL-S02-V00-Microcontroller (U1.29), STRWHL-S06-V00-Interface/STRWHL-S07-V00-EncoderInput3 (C26C.2 R31C.2)
ENC BTM4: STRWHL-S02-V00-Microcontroller (U1.57), STRWHL-S06-V00-Interface/STRWHL-S07-V00-EncoderInput4 (C26D.2 R31D.2)
ENC TOP1: STRWHL-S02-V00-Microcontroller (U1.27), STRWHL-S06-V00-Interface/STRWHL-S07-V00-EncoderInput1 (C25A.2 R29A.1)
ENC TOP2: STRWHL-S02-V00-Microcontroller (U1.50), STRWHL-S06-V00-Interface/STRWHL-S07-V00-EncoderInput2 (C25B.2 R29B.1)
ENC TOP3: STRWHL-S02-V00-Microcontroller (U1.30), STRWHL-S06-V00-Interface/STRWHL-S07-V00-EncoderInput3 (C25C.2 R29C.1)
ENC TOP4: STRWHL-S02-V00-Microcontroller (U1.56), STRWHL-S06-V00-Interface/STRWHL-S07-V00-EncoderInput4 (C25D.2 R29D.1)
FLASH CS: STRWHL-S02-V00-Microcontroller (U1.39), STRWHL-S05-V00-Screen (R24.2)
FLASH WP: STRWHL-S02-V00-Microcontroller (U1.40), STRWHL-S05-V00-Screen (R25.2)
FONT CS: STRWHL-S02-V00-Microcontroller (U1.38), STRWHL-S05-V00-Screen (R23.2)
NEO A: STRWHL-S02-V00-Microcontroller (U1.61), STRWHL-S06-V00-Interface (R26.1)
NEO B: STRWHL-S02-V00-Microcontroller (U1.62), STRWHL-S06-V00-Interface (R27.1)
RTP CS: STRWHL-S02-V00-Microcontroller (U1.58), STRWHL-S05-V00-Screen (R19.2)
RTP INT: STRWHL-S02-V00-Microcontroller (U1.59), STRWHL-S05-V00-Screen (R20.2)
SCREEN BKLIGHT: STRWHL-S02-V00-Microcontroller (U1.10), STRWHL-S05-V00-Screen (R10.2)
SCREEN CS: STRWHL-S02-V00-Microcontroller (U1.51), STRWHL-S05-V00-Screen (R14.2)
SCREEN D/C: STRWHL-S02-V00-Microcontroller (U1.52), STRWHL-S05-V00-Screen (R15.2)
SCREEN RESET: STRWHL-S02-V00-Microcontroller (U1.8), STRWHL-S05-V00-Screen (R8.2)
SCREEN TE: STRWHL-S02-V00-Microcontroller (U1.9), STRWHL-S05-V00-Screen (R9.2)
SD CS: STRWHL-S02-V00-Microcontroller (U1.37), STRWHL-S05-V00-Screen (R22.2)
SPI1 CLK: STRWHL-S02-V00-Microcontroller (U1.21), STRWHL-S05-V00-Screen (R11.2)
SPI1 MISO: STRWHL-S02-V00-Microcontroller (U1.22), STRWHL-S05-V00-Screen (R13.2)
SPI1 MOSI: STRWHL-S02-V00-Microcontroller (U1.23), STRWHL-S05-V00-Screen (R12.2)
SPI2 CLK: STRWHL-S02-V00-Microcontroller (U1.34), STRWHL-S05-V00-Screen (R16.2)
SPI2 MISO: STRWHL-S02-V00-Microcontroller (U1.35), STRWHL-S05-V00-Screen (R17.2)
SPI2 MOSI: STRWHL-S02-V00-Microcontroller (U1.36), STRWHL-S05-V00-Screen (R18.2)